# Altium schematic sheet controller.SchDoc
size A4
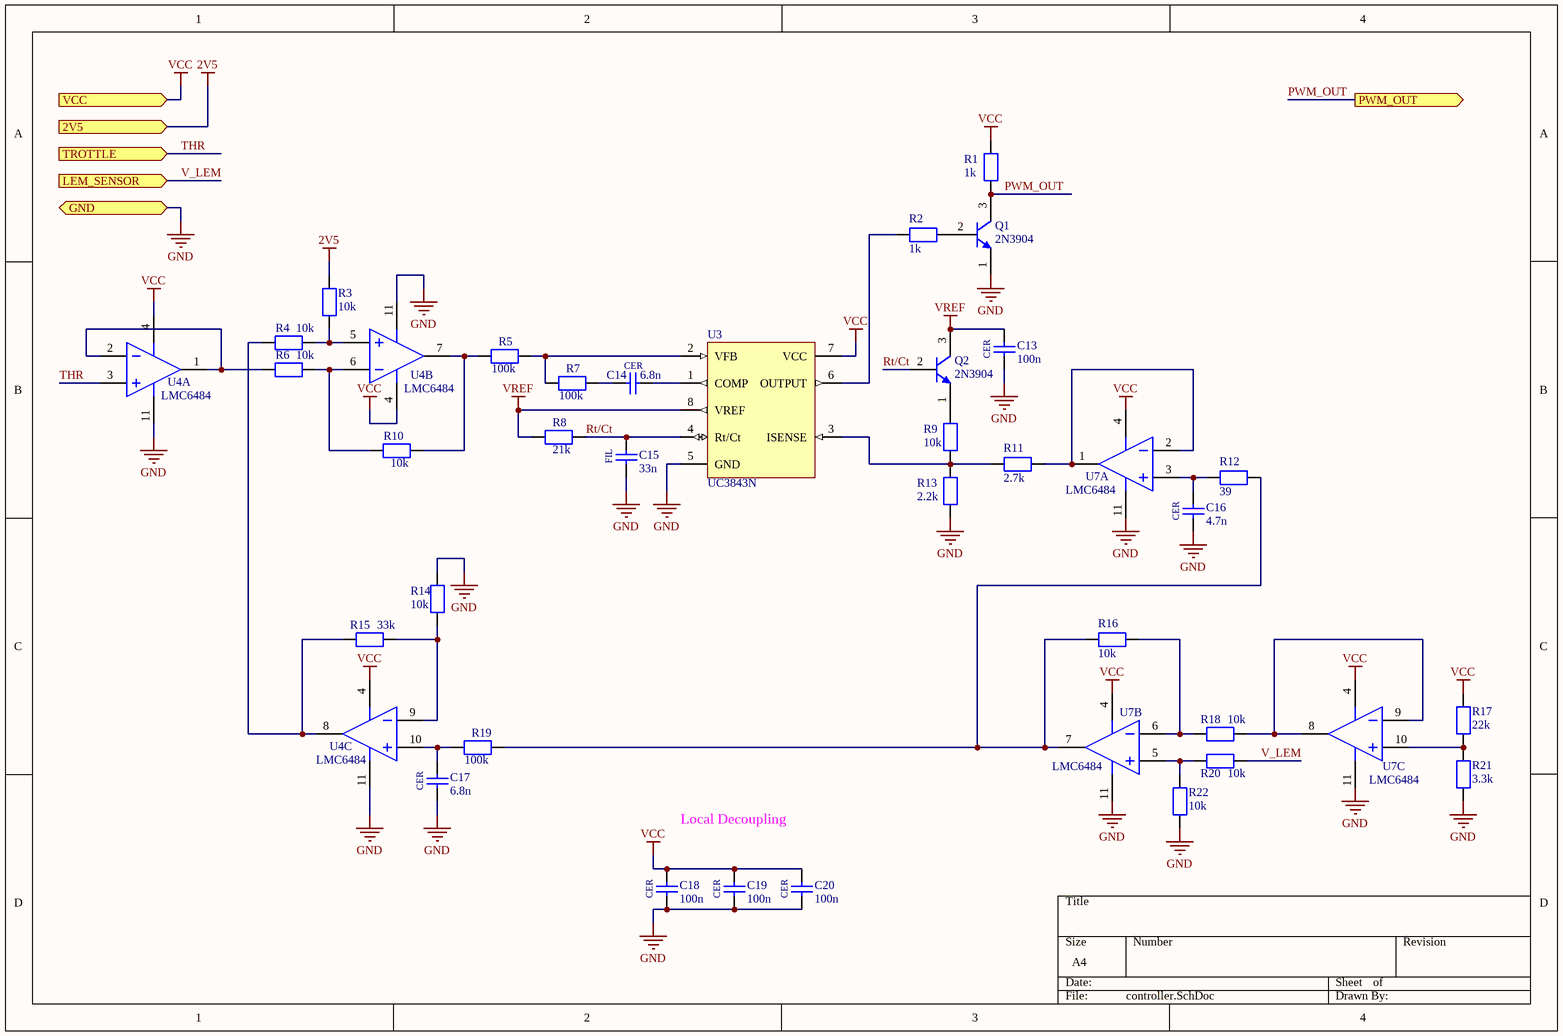
[diagram p0: controller.SchDoc]

## Parts
C13  100n  [CAP_CER_2.50]
C14  6.8n  [CAP_CER_2.50]
C15  33n  [CAP_FILM_10.0]
C16  4.7n  [CAP_CER_2.50]
C17  6.8n  [CAP_CER_2.50]
C18  100n  [CAP_CER_2.50]
C19  100n  [CAP_CER_2.50]
C20  100n  [CAP_CER_2.50]
Q1  2N3904  [ONSC-TO-92-3-29-04_AD]
Q2  2N3904  [ONSC-TO-92-3-29-04_AD]
R1  1k  [RESISTOR_THROUGH_HOLE]
R2  1k  [RESISTOR_THROUGH_HOLE]
R3  10k  [RESISTOR_THROUGH_HOLE]
R4  10k  [RESISTOR_THROUGH_HOLE]
R5  100k  [RESISTOR_THROUGH_HOLE]
R6  10k  [RESISTOR_THROUGH_HOLE]
R7  100k  [RESISTOR_THROUGH_HOLE]
R8  21k  [RESISTOR_THROUGH_HOLE]
R9  10k  [RESISTOR_THROUGH_HOLE]
R10  10k  [RESISTOR_THROUGH_HOLE]
R11  2.7k  [RESISTOR_THROUGH_HOLE]
R12  39  [RESISTOR_THROUGH_HOLE]
R13  2.2k  [RESISTOR_THROUGH_HOLE]
R14  10k  [RESISTOR_THROUGH_HOLE]
R15  33k  [RESISTOR_THROUGH_HOLE]
R16  10k  [RESISTOR_THROUGH_HOLE]
R17  22k  [RESISTOR_THROUGH_HOLE]
R18  10k  [RESISTOR_THROUGH_HOLE]
R19  100k  [RESISTOR_THROUGH_HOLE]
R20  10k  [RESISTOR_THROUGH_HOLE]
R21  3.3k  [RESISTOR_THROUGH_HOLE]
R22  10k  [RESISTOR_THROUGH_HOLE]
U3  UC3843N  [UC3843N]
U4  LMC6484  [TI-J14]  (parts A,B,C of 4)
U7  LMC6484  [TI-J14]  (parts A,B,C of 4)

## Ports
2V5 (in), GND (bidir), LEM_SENSOR (in), PWM_OUT (out), TROTTLE (in), VCC (in)

## Nets
2V5: R3.1 ; port 2V5
GND: C13.1 C15.1 C16.1 C17.1 C18.1 C19.1 C20.1 Q1.1(E) R13.2 R14.1 R21.1 R22.1 U3.5(GND) U4.11(VCC-) U7.11(VCC-) ; port GND
VCC: C18.2 C19.2 C20.2 R1.1 R17.2 U3.7(VCC) U4.4(VCC+) U7.4(VCC+) ; port VCC
VREF: C13.2 Q2.3(C) R8.1 U3.8(VREF)
PWM_OUT: Q1.3(C) R1.2 ; port PWM_OUT
Rt/Ct: C15.2 Q2.2(B) R8.2 U3.4(Rt/Ct)
THR: U4.3(IN1+) ; port TROTTLE
V_LEM: R20.2 ; port LEM_SENSOR
NetC14_1: C14.1 R7.2
NetC14_2: C14.2 U3.1(COMP)
NetC16_2: C16.2 R12.1 U7.3(IN1+)
NetC17_2: C17.2 R19.2 U4.10(IN3+)
NetQ1_2: Q1.2(B) R2.2
NetQ2_1: Q2.1(E) R9.1
NetR2_1: R2.1 U3.6(OUTPUT)
NetR3_2: R3.2 R4.2 U4.5(IN2+)
NetR4_1: R4.1 R15.1 U4.8(OUT3)
NetR5_1: R5.1 R10.1 U4.7(OUT2)
NetR5_2: R5.2 R7.1 U3.2(VFB)
NetR6_1: R6.1 R10.2 U4.6(IN2-)
NetR6_2: R6.2 U4.1(OUT1) U4.2(IN1-)
NetR9_2: R9.2 R11.1 R13.1 U3.3(ISENSE)
NetR11_2: R11.2 U7.1(OUT1) U7.2(IN1-)
NetR12_2: R12.2 R16.1 R19.1 U7.7(OUT2)
NetR14_2: R14.2 R15.2 U4.9(IN3-)
NetR16_2: R16.2 R18.1 U7.6(IN2-)
NetR17_1: R17.1 R21.2 U7.10(IN3+)
NetR18_2: R18.2 U7.8(OUT3) U7.9(IN3-)
NetR20_1: R20.1 R22.2 U7.5(IN2+)

## Notes on the sheet
- Local Decoupling
- (in symbol CAP_CER) CER
- (in symbol CAP_FILM) FIL

## Library data of the parts
C13 C14 C16-C20 = CAP_CER: Value: F
C15 = CAP_FILM: Value: F
R1-R22 = Resistor: Value: k
U3 = UC3843N: PWM Controller with Current Control, 100 % Duty Cycle, 0 to +70 degC, 8-pin PDIP (P), Green (RoHS & no Sb/Br); Manufacturer: Texas Instruments; Duty Cycle(Max)(%): 100; Frequency(Max)(kHz): 450; Rating: Catalog; Regulated Outputs(#): 1; Topology: Boost, Buck, Flyback, Forward; UVLO Thresholds On/Off(V): 8.4/7.6; DatasheetVersion: SLUS223C; PackageVersion: revE, Apr-2010; PackageReference: P8; PackageDescription: 8-Pin Plastic Dual-In-Line Package, Row Spacing 7.62 mm, Pitch 2.54 mm; Supplier 1: Digi-Key; Supplier Part Number 1: 296-11288-5-ND; Supplier 2: Farnell; Supplier Part Number 2: 2164381; Supplier 3: Newark; Supplier Part Number 3: 74K4014; Supplier 4: Mouser; Supplier Part Number 4: 595-UC3843N; Control Method: Current; Eco-Plan: Green (RoHS & no Sb/Br); SubFamily: PWM Controller; Mounting Technology: Through Hole; PartNumber: UC3843N; Code_JEDEC: MS-001-BA; ComponentLink1Description: Datasheet; ComponentLink1URL: http://www.ti.com/general/docs/lit/getliterature.tsp?genericPartNumber=UC3843&fileType=pdf
Q1 Q2 = 2N3904: ComponentLink1Description: Manufacturer URL; ComponentLink1URL: http://www.onsemi.com/; ComponentLink2Description: Datasheet; ComponentLink2URL: http://www.onsemi.com/pub_link/Collateral/BC549B-D.PDF; ComponentLink3Description: Package Specification; ComponentLink3URL: http://www.onsemi.com/pub_link/Collateral/BC549B-D.PDF
U4 U7 = LMC6484: ComponentLink1Description: Manufacturer URL; ComponentLink1URL: http://www.ti.com/; ComponentLink2Description: Datasheet; ComponentLink2URL: http://www.ti.com/lit/ds/symlink/tl064m.pdf; ComponentLink3Description: Package Specification; ComponentLink3URL: http://www.ti.com/litv/pdf/mcer002d